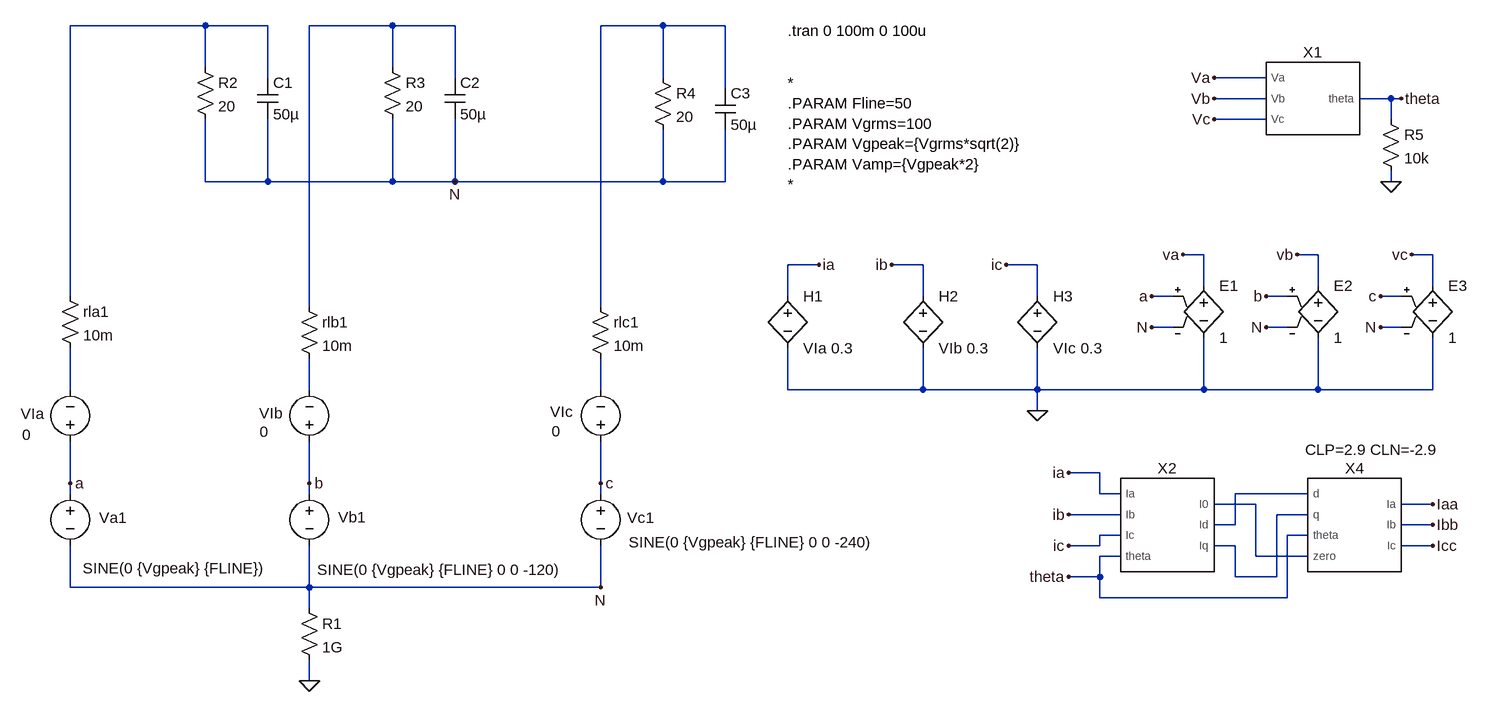
[diagram p0: schematic test dq0 inv_dq0.asc]
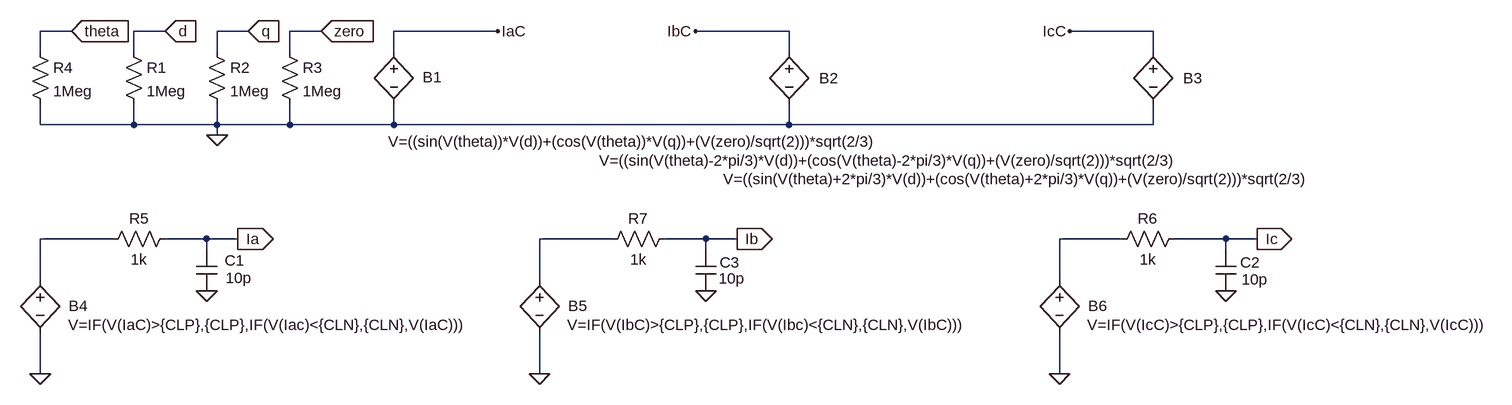
[diagram p1: sub-circuit inverse_dq0.asc]
test dq0 inv_dq0.asc, the LTspice schematic file:
Version 4
SHEET 1 2248 1388
WIRE 48 -256 -160 -256
WIRE 144 -256 48 -256
WIRE 336 -256 208 -256
WIRE 432 -256 336 -256
WIRE 752 -256 656 -256
WIRE 848 -256 752 -256
WIRE 48 -192 48 -256
WIRE 336 -192 336 -256
WIRE 144 -176 144 -256
WIRE 432 -176 432 -256
WIRE 752 -176 752 -256
WIRE 1680 -176 1600 -176
WIRE 848 -160 848 -256
WIRE 1680 -144 1600 -144
WIRE 1872 -144 1824 -144
WIRE 1888 -144 1872 -144
WIRE 1680 -112 1600 -112
WIRE 1872 -112 1872 -144
WIRE 48 -16 48 -112
WIRE 144 -16 144 -112
WIRE 144 -16 48 -16
WIRE 336 -16 336 -112
WIRE 336 -16 144 -16
WIRE 432 -16 432 -112
WIRE 432 -16 336 -16
WIRE 752 -16 752 -96
WIRE 752 -16 432 -16
WIRE 848 -16 848 -96
WIRE 848 -16 752 -16
WIRE 1872 -16 1872 -32
WIRE 1584 96 1552 96
WIRE 1760 96 1728 96
WIRE 1936 96 1904 96
WIRE 992 112 944 112
WIRE 1152 112 1104 112
WIRE 1328 112 1280 112
WIRE 1584 144 1584 96
WIRE 1760 144 1760 96
WIRE 1936 144 1936 96
WIRE -160 160 -160 -256
WIRE 944 160 944 112
WIRE 1152 160 1152 112
WIRE 1328 160 1328 112
WIRE 1536 160 1504 160
WIRE 1712 160 1680 160
WIRE 1888 160 1856 160
WIRE 208 176 208 -256
WIRE 656 176 656 -256
WIRE 1536 208 1504 208
WIRE 1712 208 1680 208
WIRE 1888 208 1856 208
WIRE -160 304 -160 240
WIRE 208 304 208 256
WIRE 656 304 656 256
WIRE 944 304 944 240
WIRE 1152 304 1152 240
WIRE 1152 304 944 304
WIRE 1328 304 1328 240
WIRE 1328 304 1152 304
WIRE 1584 304 1584 224
WIRE 1584 304 1328 304
WIRE 1760 304 1760 224
WIRE 1760 304 1584 304
WIRE 1936 304 1936 224
WIRE 1936 304 1760 304
WIRE 1328 336 1328 304
WIRE 1424 432 1376 432
WIRE -160 448 -160 384
WIRE 208 448 208 384
WIRE 656 448 656 384
WIRE -160 464 -160 448
WIRE 208 464 208 448
WIRE 656 464 656 448
WIRE 1424 464 1424 432
WIRE 1456 464 1424 464
WIRE 1744 464 1632 464
WIRE 1664 480 1600 480
WIRE 1936 480 1888 480
WIRE 1456 496 1376 496
WIRE 1744 496 1696 496
WIRE 1632 512 1632 464
WIRE 1632 512 1600 512
WIRE 1936 512 1888 512
WIRE 1456 528 1424 528
WIRE 1744 528 1712 528
WIRE 1424 544 1424 528
WIRE 1424 544 1376 544
WIRE 1632 544 1600 544
WIRE 1936 544 1888 544
WIRE 1456 560 1424 560
WIRE 1664 560 1664 480
WIRE 1744 560 1664 560
WIRE 1424 592 1424 560
WIRE 1424 592 1376 592
WIRE 1632 592 1632 544
WIRE 1696 592 1696 496
WIRE 1696 592 1632 592
WIRE -160 608 -160 544
WIRE 208 608 208 544
WIRE 208 608 -160 608
WIRE 656 608 656 544
WIRE 656 608 208 608
WIRE 1424 624 1424 592
WIRE 1712 624 1712 528
WIRE 1712 624 1424 624
WIRE 208 640 208 608
WIRE 208 752 208 720
FLAG 208 752 0
FLAG -160 448 a
FLAG 208 448 b
FLAG 656 448 c
FLAG 656 608 N
FLAG 992 112 ia
FLAG 1104 112 ib
FLAG 1280 112 ic
FLAG 1552 96 va
FLAG 1504 208 N
FLAG 1504 160 a
FLAG 1728 96 vb
FLAG 1680 208 N
FLAG 1680 160 b
FLAG 1904 96 vc
FLAG 1856 208 N
FLAG 1856 160 c
FLAG 1328 336 0
FLAG 432 -16 N
FLAG 1888 -144 theta
FLAG 1600 -176 Va
FLAG 1600 -144 Vb
FLAG 1600 -112 Vc
FLAG 1376 432 ia
FLAG 1376 496 ib
FLAG 1376 544 ic
FLAG 1376 592 theta
FLAG 1872 -16 0
FLAG 1936 480 Iaa
FLAG 1936 512 Ibb
FLAG 1936 544 Icc
SYMBOL voltage -160 448 R0
WINDOW 0 45 53 Left 2
WINDOW 3 19 131 Left 2
WINDOW 123 0 0 Left 0
WINDOW 39 0 0 Left 0
SYMATTR InstName Va1
SYMATTR Value SINE(0 {Vgpeak} {FLINE})
SYMBOL voltage 208 448 R0
WINDOW 0 44 52 Left 2
WINDOW 3 12 133 Left 2
WINDOW 123 0 0 Left 0
WINDOW 39 0 0 Left 0
SYMATTR InstName Vb1
SYMATTR Value SINE(0 {Vgpeak} {FLINE} 0 0 -120)
SYMBOL voltage 656 448 R0
WINDOW 0 41 53 Left 2
WINDOW 3 43 91 Left 2
WINDOW 123 0 0 Left 0
WINDOW 39 0 0 Left 0
SYMATTR InstName Vc1
SYMATTR Value SINE(0 {Vgpeak} {FLINE} 0 0 -240)
SYMBOL res 192 624 R0
SYMATTR InstName R1
SYMATTR Value 1G
SYMBOL res -176 144 R0
SYMATTR InstName rla1
SYMATTR Value 10m
SYMBOL res 192 160 R0
SYMATTR InstName rlb1
SYMATTR Value 10m
SYMBOL res 640 160 R0
SYMATTR InstName rlc1
SYMATTR Value 10m
SYMBOL voltage -160 400 R180
WINDOW 0 40 59 Left 2
WINDOW 3 60 27 Left 2
WINDOW 123 0 0 Left 0
WINDOW 39 0 0 Left 0
SYMATTR InstName VIa
SYMATTR Value 0
SYMBOL voltage 208 400 R180
WINDOW 0 41 60 Left 2
WINDOW 3 63 31 Left 2
WINDOW 123 0 0 Left 0
WINDOW 39 0 0 Left 0
SYMATTR InstName VIb
SYMATTR Value 0
SYMBOL voltage 656 400 R180
WINDOW 0 43 62 Left 2
WINDOW 3 62 32 Left 2
WINDOW 123 0 0 Left 0
WINDOW 39 0 0 Left 0
SYMATTR InstName VIc
SYMATTR Value 0
SYMBOL h 944 144 R0
SYMATTR InstName H1
SYMATTR Value VIa 0.3
SYMBOL h 1152 144 R0
SYMATTR InstName H2
SYMATTR Value VIb 0.3
SYMBOL h 1328 144 R0
SYMATTR InstName H3
SYMATTR Value VIc 0.3
SYMBOL e 1584 128 R0
SYMATTR InstName E1
SYMATTR Value 1
SYMBOL e 1760 128 R0
SYMATTR InstName E2
SYMATTR Value 1
SYMBOL e 1936 128 R0
SYMATTR InstName E3
SYMATTR Value 1
SYMBOL res 32 -208 R0
SYMATTR InstName R2
SYMATTR Value 20
SYMBOL res 320 -208 R0
SYMATTR InstName R3
SYMATTR Value 20
SYMBOL res 736 -192 R0
SYMATTR InstName R4
SYMATTR Value 20
SYMBOL cap 128 -176 R0
SYMATTR InstName C1
SYMATTR Value 50µ
SYMBOL cap 416 -176 R0
SYMATTR InstName C2
SYMATTR Value 50µ
SYMBOL cap 832 -160 R0
SYMATTR InstName C3
SYMATTR Value 50µ
SYMBOL theta_sub 1744 -144 R0
SYMATTR InstName X1
SYMBOL dq0_sub 1520 512 R0
SYMATTR InstName X2
SYMBOL res 1856 -128 R0
SYMATTR InstName R5
SYMATTR Value 10k
SYMBOL Inverse_dq0 1808 512 R0
WINDOW 39 35 -100 Bottom 2
SYMATTR SpiceLine CLP=2.9 CLN=-2.9
SYMATTR InstName X4
TEXT 944 -168 Left 2 !*\n.PARAM Fline=50\n.PARAM Vgrms=100\n.PARAM Vgpeak={Vgrms*sqrt(2)}\n.PARAM Vamp={Vgpeak*2}\n*
TEXT 944 -248 Left 2 !.tran 0 100m 0 100u

inverse_dq0.asc, the sub-circuit schematic file:
Version 4
SHEET 1 1804 980
WIRE -464 16 -512 16
WIRE -320 16 -368 16
WIRE -192 16 -240 16
WIRE -80 16 -128 16
WIRE 192 16 32 16
WIRE 640 16 496 16
WIRE 1200 16 1072 16
WIRE -512 48 -512 16
WIRE -368 48 -368 16
WIRE -240 48 -240 16
WIRE -128 48 -128 16
WIRE 32 48 32 16
WIRE 640 48 640 16
WIRE 1200 48 1200 16
WIRE -512 160 -512 128
WIRE -368 160 -368 128
WIRE -368 160 -512 160
WIRE -240 160 -240 128
WIRE -240 160 -368 160
WIRE -128 160 -128 128
WIRE -128 160 -240 160
WIRE 32 160 32 128
WIRE 32 160 -128 160
WIRE 640 160 640 128
WIRE 640 160 32 160
WIRE 1200 160 1200 128
WIRE 1200 160 640 160
WIRE -240 176 -240 160
WIRE -400 336 -512 336
WIRE -256 336 -320 336
WIRE -208 336 -256 336
WIRE 368 336 256 336
WIRE 512 336 448 336
WIRE 560 336 512 336
WIRE 1152 336 1056 336
WIRE 1312 336 1232 336
WIRE 1360 336 1312 336
WIRE -256 352 -256 336
WIRE 512 352 512 336
WIRE 1312 352 1312 336
WIRE -512 400 -512 336
WIRE 256 400 256 336
WIRE 1056 400 1056 336
WIRE -512 544 -512 480
WIRE 256 544 256 480
WIRE 1056 544 1056 480
FLAG -240 176 0
FLAG -320 16 d
IOPIN -320 16 In
FLAG -192 16 q
IOPIN -192 16 In
FLAG -80 16 zero
IOPIN -80 16 In
FLAG 192 16 IaC
FLAG 496 16 IbC
FLAG 1072 16 IcC
FLAG -464 16 theta
IOPIN -464 16 In
FLAG -208 336 Ia
IOPIN -208 336 Out
FLAG -512 544 0
FLAG 560 336 Ib
IOPIN 560 336 Out
FLAG 256 544 0
FLAG 1360 336 Ic
IOPIN 1360 336 Out
FLAG 1056 544 0
FLAG -256 416 0
FLAG 1312 416 0
FLAG 512 416 0
SYMBOL res -384 32 R0
SYMATTR InstName R1
SYMATTR Value 1Meg
SYMBOL res -256 32 R0
SYMATTR InstName R2
SYMATTR Value 1Meg
SYMBOL res -144 32 R0
SYMATTR InstName R3
SYMATTR Value 1Meg
SYMBOL bv 32 32 R0
WINDOW 0 44 55 Left 2
WINDOW 3 -9 154 Left 2
SYMATTR InstName B1
SYMATTR Value V=((sin(V(theta))*V(d))+(cos(V(theta))*V(q))+(V(zero)/sqrt(2)))*sqrt(2/3)
SYMBOL bv 640 32 R0
WINDOW 0 46 56 Left 2
WINDOW 3 -292 183 Left 2
SYMATTR InstName B2
SYMATTR Value V=((sin(V(theta)-2*pi/3)*V(d))+(cos(V(theta)-2*pi/3)*V(q))+(V(zero)/sqrt(2)))*sqrt(2/3)
SYMBOL res -528 32 R0
SYMATTR InstName R4
SYMATTR Value 1Meg
SYMBOL bv 1200 32 R0
WINDOW 0 46 56 Left 2
WINDOW 3 -661 212 Left 2
SYMATTR InstName B3
SYMATTR Value V=((sin(V(theta)+2*pi/3)*V(d))+(cos(V(theta)+2*pi/3)*V(q))+(V(zero)/sqrt(2)))*sqrt(2/3)
SYMBOL bv -512 384 R0
WINDOW 0 44 55 Left 2
WINDOW 3 43 84 Left 2
SYMATTR InstName B4
SYMATTR Value V=IF(V(IaC)>{CLP},{CLP},IF(V(Iac)<{CLN},{CLN},V(IaC)))
SYMBOL bv 256 384 R0
WINDOW 0 44 55 Left 2
WINDOW 3 43 84 Left 2
SYMATTR InstName B5
SYMATTR Value V=IF(V(IbC)>{CLP},{CLP},IF(V(Ibc)<{CLN},{CLN},V(IbC)))
SYMBOL bv 1056 384 R0
WINDOW 0 44 55 Left 2
WINDOW 3 43 84 Left 2
SYMATTR InstName B6
SYMATTR Value V=IF(V(IcC)>{CLP},{CLP},IF(V(IcC)<{CLN},{CLN},V(IcC)))
SYMBOL res -304 320 R90
WINDOW 0 0 56 VBottom 2
WINDOW 3 32 56 VTop 2
SYMATTR InstName R5
SYMATTR Value 1k
SYMBOL res 1248 320 R90
WINDOW 0 0 56 VBottom 2
WINDOW 3 32 56 VTop 2
SYMATTR InstName R6
SYMATTR Value 1k
SYMBOL res 464 320 R90
WINDOW 0 0 56 VBottom 2
WINDOW 3 32 56 VTop 2
SYMATTR InstName R7
SYMATTR Value 1k
SYMBOL cap -272 352 R0
WINDOW 0 44 17 Left 2
WINDOW 3 45 44 Left 2
SYMATTR InstName C1
SYMATTR Value 10p
SYMBOL cap 1296 352 R0
WINDOW 0 38 20 Left 2
WINDOW 3 40 46 Left 2
SYMATTR InstName C2
SYMATTR Value 10p
SYMBOL cap 496 352 R0
WINDOW 0 37 20 Left 2
WINDOW 3 36 45 Left 2
SYMATTR InstName C3
SYMATTR Value 10p

The netlist it stands for:
* test dq0 inv_dq0.asc
Va1 a N SINE(0 {Vgpeak} {FLINE})
Vb1 b N SINE(0 {Vgpeak} {FLINE} 0 0 -120)
Vc1 c N SINE(0 {Vgpeak} {FLINE} 0 0 -240)
R1 N 0 1G
rla1 N001 N004 10m
rlb1 N002 N005 10m
rlc1 N003 N006 10m
VIa a N004 0
VIb b N005 0
VIc c N006 0
H1 ia 0 VIa 0.3
H2 ib 0 VIb 0.3
H3 ic 0 VIc 0.3
E1 va 0 a N 1
E2 vb 0 b N 1
E3 vc 0 c N 1
R2 N001 N 20
R3 N002 N 20
R4 N003 N 20
C1 N001 N 50µ
C2 N002 N 50µ
C3 N003 N 50µ
XX1 va vb vc theta theta_sub  ; pins Va Vb Vc theta
XX2 ia ib ic theta N008 N007 N009 dq0_sub  ; pins Ia Ib Ic theta I0 Id Iq
R5 theta 0 10k
XX4 N007 N009 theta N008 Iaa Ibb Icc inverse_dq0 params: CLP=2.9 CLN=-2.9

* block symbol definitions
.subckt inverse_dq0 d q theta zero Ia Ib Ic
R1 d 0 1Meg
R2 q 0 1Meg
R3 zero 0 1Meg
B1 IaC 0 V=((sin(V(theta))*V(d))+(cos(V(theta))*V(q))+(V(zero)/sqrt(2)))*sqrt(2/3)
B2 IbC 0 V=((sin(V(theta)-2*pi/3)*V(d))+(cos(V(theta)-2*pi/3)*V(q))+(V(zero)/sqrt(2)))*sqrt(2/3)
R4 theta 0 1Meg
B3 IcC 0 V=((sin(V(theta)+2*pi/3)*V(d))+(cos(V(theta)+2*pi/3)*V(q))+(V(zero)/sqrt(2)))*sqrt(2/3)
B4 N001 0 V=IF(V(IaC)>{CLP},{CLP},IF(V(Iac)<{CLN},{CLN},V(IaC)))
B5 N002 0 V=IF(V(IbC)>{CLP},{CLP},IF(V(Ibc)<{CLN},{CLN},V(IbC)))
B6 N003 0 V=IF(V(IcC)>{CLP},{CLP},IF(V(IcC)<{CLN},{CLN},V(IcC)))
R5 Ia N001 1k
R6 Ic N003 1k
R7 Ib N002 1k
C1 Ia 0 10p
C2 Ic 0 10p
C3 Ib 0 10p
.ends inverse_dq0

*
.PARAM Fline=50
.PARAM Vgrms=100
.PARAM Vgpeak={Vgrms*sqrt(2)}
.PARAM Vamp={Vgpeak*2}
*
.tran 0 100m 0 100u
.backanno
.end